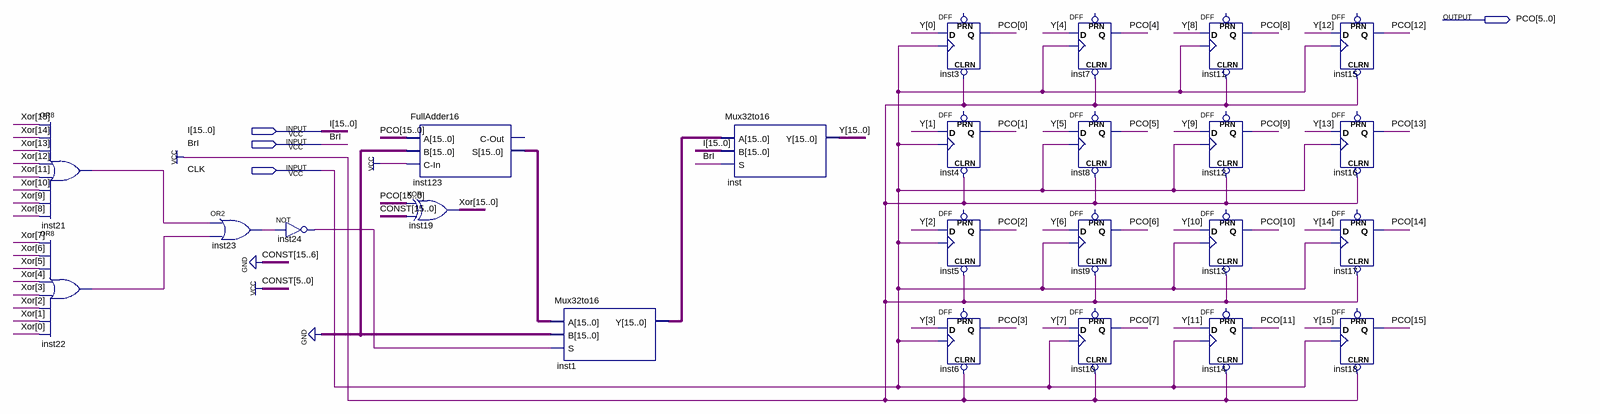
[diagram p0: schematic sheet]
// Quartus schematic PC.bdf as structural Verilog: 24 symbols, 4 pins
module PC (
  input  [15:0] I,
  input  BrI,
  input  CLK,
  output [15:0] PCO
);

  wire inst21_out, inst22_out, inst23_out, inst24_out;
  wire [15:0] inst1_y, inst123_s, Xor, Y;

  or inst21 (inst21_out, Xor[15], Xor[14], Xor[13], Xor[12], Xor[11], Xor[10], Xor[9], Xor[8]);
  or inst22 (inst22_out, Xor[7], Xor[6], Xor[5], Xor[4], Xor[3], Xor[2], Xor[1], Xor[0]);
  or inst23 (inst23_out, inst21_out, inst22_out);
  not inst24 (inst24_out, inst23_out);
  FullAdder16 inst123 (.A(PCO), .B({16{1'b0}}), .\C-In (1'b1), .S(inst123_s));  // open: C-Out
  assign Xor = PCO ^ 16'b0000000000111111;  // XOR inst19, 16 bits wide
  Mux32to16 inst1 (.A(inst123_s), .B({16{1'b0}}), .S(inst24_out), .Y(inst1_y));
  Mux32to16 inst (.A(inst1_y), .B(I), .S(BrI), .Y(Y));
  DFF inst3 (.CLRN(1'b1), .CLK(CLK), .D(Y[0]), .Q(PCO[0]));  // open: PRN
  DFF inst4 (.CLRN(1'b1), .CLK(CLK), .D(Y[1]), .Q(PCO[1]));  // open: PRN
  DFF inst5 (.CLRN(1'b1), .CLK(CLK), .D(Y[2]), .Q(PCO[2]));  // open: PRN
  DFF inst6 (.CLRN(1'b1), .CLK(CLK), .D(Y[3]), .Q(PCO[3]));  // open: PRN
  DFF inst7 (.CLRN(1'b1), .CLK(CLK), .D(Y[4]), .Q(PCO[4]));  // open: PRN
  DFF inst8 (.CLRN(1'b1), .CLK(CLK), .D(Y[5]), .Q(PCO[5]));  // open: PRN
  DFF inst9 (.CLRN(1'b1), .CLK(CLK), .D(Y[6]), .Q(PCO[6]));  // open: PRN
  DFF inst10 (.CLRN(1'b1), .CLK(CLK), .D(Y[7]), .Q(PCO[7]));  // open: PRN
  DFF inst11 (.CLRN(1'b1), .CLK(CLK), .D(Y[8]), .Q(PCO[8]));  // open: PRN
  DFF inst12 (.CLRN(1'b1), .CLK(CLK), .D(Y[9]), .Q(PCO[9]));  // open: PRN
  DFF inst13 (.CLRN(1'b1), .CLK(CLK), .D(Y[10]), .Q(PCO[10]));  // open: PRN
  DFF inst14 (.CLRN(1'b1), .CLK(CLK), .D(Y[11]), .Q(PCO[11]));  // open: PRN
  DFF inst15 (.CLRN(1'b1), .CLK(CLK), .D(Y[12]), .Q(PCO[12]));  // open: PRN
  DFF inst16 (.CLRN(1'b1), .CLK(CLK), .D(Y[13]), .Q(PCO[13]));  // open: PRN
  DFF inst17 (.CLRN(1'b1), .CLK(CLK), .D(Y[14]), .Q(PCO[14]));  // open: PRN
  DFF inst18 (.CLRN(1'b1), .CLK(CLK), .D(Y[15]), .Q(PCO[15]));  // open: PRN
endmodule
